# Altium schematic sheet 2_Microcontrolador.SchDoc
size A4; SheetNumber: 3; SheetTotal: 4; SPICEModelCacheOGEEZERP: <root> / <DocumentId>OGEEZERP</DocumentId> / </root>
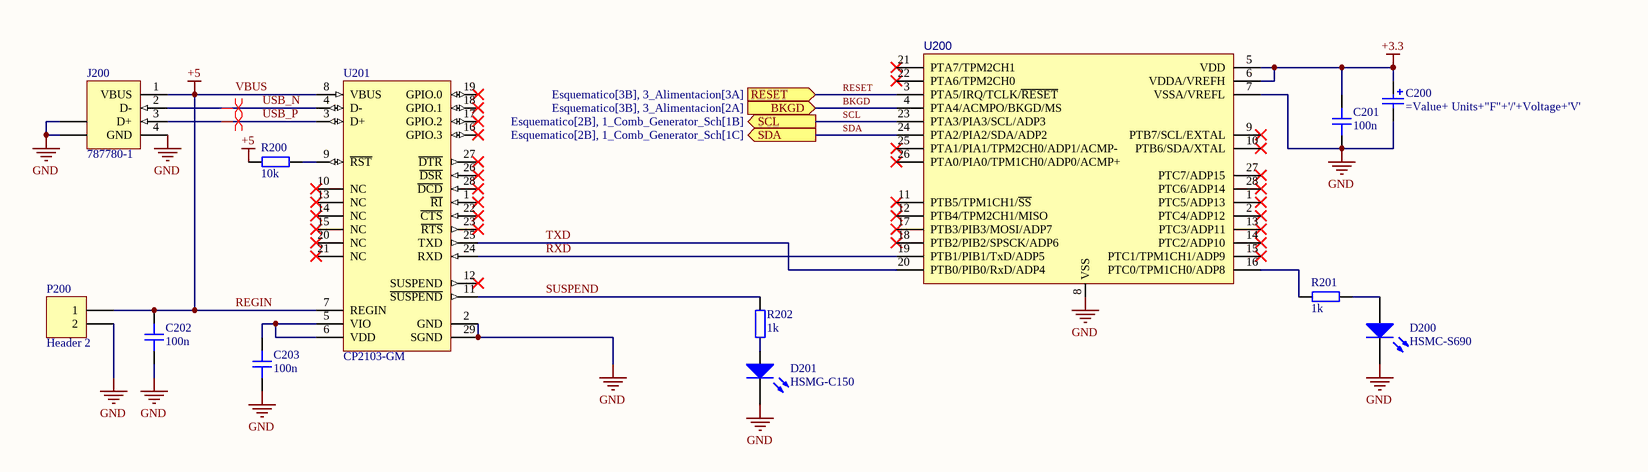
[diagram p0: 2_Microcontrolador.SchDoc]

## Parts
C200  (no value)  [C SIZE SMD CAPACITOR]
C201  100n  [CAP_0603]
C202  100n  [CAP_0603]
C203  100n  [CAP_0603]
D200  HSMC-S690  [1.6X0.8X0.7]
D201  HSMG-C150  [3.2X1.6X1.1]
J200  787780-1  [USB 787780]
P200  Header 2  [HDR1X2]
R200  10k  [RES_0603]
R201  1k  [RES_0603]
R202  1k  [RES_0603]
U200  (no value)  [TSSOP28_25.5_295_15X58_SMD]
U201  CP2103-GM  [SLAB-QFN-28-3125x3125TP_A_N]

## Ports
BKGD (in, see Esquematico[3B], 3_Alimentacion[2A]), RESET (in, see Esquematico[3B], 3_Alimentacion[3A]), SCL (out, see Esquematico[2B], 1_Comb_Generator_Sch[1B]), SDA (out, see Esquematico[2B], 1_Comb_Generator_Sch[1C])

## Nets
+3.3: C200.1 C201.1 U200.5(VDD) U200.6(VDDA/VREFH)
GND: C200.2 C201.2 C202.2 C203.2 D200.2(K) D201.2(K) J200.4(GND) J200.5(SHLD) J200.6(SHLD) P200.2 U200.7(VSSA/VREFL) U200.8(VSS) U201.2(GND) U201.29(SGND)
REGIN: C202.1 J200.1(VBUS) P200.1 R200.2 U201.7(REGIN) U201.8(VBUS)  [also labelled +5, VBUS]
BKGD: U200.4(PTA4/ACMPO/BKGD/MS) ; port BKGD
RESET: U200.3(PTA5/IRQ/TCLK/~{RESET}) ; port RESET
RXD: U200.19(PTB1/PIB1/TxD/ADP5) U201.24(RXD)
SCL: U200.23(PTA3/PIA3/SCL/ADP3) ; port SCL
SDA: U200.24(PTA2/PIA2/SDA/ADP2) ; port SDA
SUSPEND: R202.1 U201.11(~{SUSPEND})
TXD: U200.20(PTB0/PIB0/RxD/ADP4) U201.25(TXD)
USB_N: J200.2(D-) U201.4(D-)
USB_P: J200.3(D+) U201.3(D+)
NetC203_1: C203.1 U201.5(VIO) U201.6(VDD)
NetD200_1: D200.1(A) R201.2
NetD201_1: D201.1(A) R202.2
NetR200_1: R200.1 U201.9(~{RST})
NetR201_1: R201.1 U200.16(PTC0/TPM1CH0/ADP8)

Not connected (* = marked no-connect by the designer): U200 1(PTC5/ADP13)* 2(PTC4/ADP12)* 9(PTB7/SCL/EXTAL)* 10(PTB6/SDA/XTAL)* 11(PTB5/TPM1CH1/~{SS})* 12(PTB4/TPM2CH1/MISO)* 13(PTC3/ADP11)* 14(PTC2/ADP10)* 15(PTC1/TPM1CH1/ADP9)* 17(PTB3/PIB3/MOSI/ADP7)* 18(PTB2/PIB2/SPSCK/ADP6)* 21(PTA7/TPM2CH1)* 22(PTA6/TPM2CH0)* 25(PTA1/PIA1/TPM2CH0/ADP1/ACMP-)* 26(PTA0/PIA0/TPM1CH0/ADP0/ACMP+)* 27(PTC7/ADP15)* 28(PTC6/ADP14)*; U201 1(~{RI})* 10(NC)* 12(SUSPEND)* 13(NC)* 14(NC)* 15(NC)* 16(GPIO.3)* 17(GPIO.2)* 18(GPIO.1)* 19(GPIO.0)* 20(NC)* 21(NC)* 22(~{CTS})* 23(~{RTS})* 26(~{DSR})* 27(~{DTR})* 28(~{DCD})*

## Layout directives
differential pair; differential pair class USB: USB_N, USB_P

## Library data of the parts
C200 = Cap Pol1: Capacitor Electr. Alum. SMD WxLxH 6.3x6.3x5.3 Ǿ= 6 mm; Manufacturer: Generic Components; Class: Passive; Value: 47; PDT: PDT_GA500P+; CRITICO: NO; Voltage: 16; Diam: 6.3; Units: u; ASY_DESCRIPTION: Electrónica Galert 500P+; ASY_CRITICO: S; ELEMON: EH51EM470E05OC; Published: 08/06/2000; Publisher: Altium Hobart Technology Centre; SubClass: Capacitor; GAMMASYS: =C+auto_range + ''+Exponent+Material+Voltage+ PackageReference; ASY: =PS+PCB+'R'+PCB_REV; PackageReference: 0607; Height: 10; auto_range: =(NORM >= 1) * (NORM < 100) * NORM + (NORM >= 1E2) * (NORM < 1E3) * NORM / 10 + (NORM >= 1E3) * (NORM < 1E4) * NORM / 1E2 + (NORM >= 1E4) * (NORM < 1E5) * NORM / 1E3 + (NORM >= 1E5) * (NORM < 1E6) * NORM / 1E4 + (NORM >= 1E6) * (NORM < 1E7) * NORM / 1E5 + (NORM >= 1E7) * (NORM < 1E8) * NORM / 1E6 + (NORM >= 1E8) * (NORM < 1E9) * NORM / 1E7 + (NORM >= 1E9) * (NORM < 1E10) * NORM / 1E8 + (NORM >= 1E10) * (NORM < 1E11) * NORM / 1E9; Exponent: =(NORM >= 1) * (NORM < 1E2) * 0 || (NORM >= 1E2) * (NORM < 1E3) * 1 || (NORM >= 1e3) * (NORM < 1e4) * 2 ||(NORM >= 1E4) * (NORM < 1E5) * 3 || (NORM >= 1E5) * (NORM < 1E6) * 4 || (NORM >= 1E6) * (NORM < 1E7) * 5 || (NORM >= 1E7) * (NORM < 1E8) * 6 || (NORM >= 1E8) * (NORM < 1E9) * 7 || (NORM >= 1E9) * (NORM < 1E10) * 8 || (NORM >= 1E10) * (NORM < 1E11) * 9; NORM: =-(not (Units <> m) * 1E3 + not (Units <> u)*1E0 )*Value
C201-C203 = CAP_0603: Capacitor SMD 0603; Manufacturer: *; Manufacturer Part Number: *; Distributor Link: *; LCSC: *; Rating: *; Dielectric: *
D200 = HSMC-S690: SMT Top Mount Chip LED, Red; LuminousIntensity: 16mcd (Minimum).; PCB_Layout: Complies with manufacturer's recommendation.; Published: 11-Dec-2002; DatasheetDocument: 29-Oct-2001; PackageDocument: 29-Oct-2001; PackageReference: 1.6X0.8X0.7; Publisher: Altium Limited; LED_Colour: Red; ComponentLink1Description: Manufacturer Link; ComponentLink1URL: http://www.agilent.com/; ComponentLink2Description: Datasheet; ComponentLink2URL: http://cp.literature.agilent.com/litweb/pdf/5988-4445EN.pdf
D201 = HSMG-C150: Surface Mount Chip LED, Green; LuminousIntensity: 4mcd (Minimum).; PCB_Layout: Complies with manufacturer's recommendation.; Published: 11-Dec-2002; DatasheetDocument: 30-Apr-2002; PackageDocument: 26-Feb-2002; PackageReference: 3.2X1.6X1.1; Publisher: Altium Limited; LED_Colour: Green; ComponentLink1Description: Manufacturer Link; ComponentLink1URL: http://www.agilent.com/; ComponentLink2Description: Datasheet; ComponentLink2URL: http://cp.literature.agilent.com/litweb/pdf/5988-6271EN.pdf
J200 = 787780-1: USB 1.1, Right Angle, Thru-Hole, B Type, Receptacle, 4 Position, Black; ContactMaterial: Copper Alloy; ContactPlating: Gold Flash over Palladium Nickel or Gold (30) over Nickel; TerminationLength: 3.00mm [0.118in.]; PCB_Layout: Complies with manufacturer's recommendation.; DrillSize: Corresponds to nominal value.; PanelGround: Without; Published: 15-Jul-2004; DatasheetDocument: 11-Jan-2004; PackageDocument: 11-Jan-2004; PackageReference: 787780; Publisher: Altium Limited; HousingMaterial: Thermoplastic; ComponentLink1Description: Manufacturer Link; ComponentLink1URL: http://www.tycoelectronics.com/; ComponentLink2Description: Packaging Specification; ComponentLink2URL: http://ecommas.tycoelectronics.com/commerce/DocumentDelivery/DDEController?Action=showdoc&DocId=Customer+Drawing%7F787780%7FF%7Ftif%7FEnglish%7FENG_CD_787780_F.tif
P200 = Header 2: Header, 2-Pin; LatestRevisionDate: 17-Jul-2002; LatestRevisionNote: Re-released for DXP Platform.; Publisher: Altium Limited
R200-R202 = RES_0603: Resistor SMD 0603; Manufacturer: *; Manufacturer Part Number: *; Distributor Link: *; LCSC: *
U200 = MC9S08SH32CTL: IC MCU 8BIT 32KB FLASH 28TSSOP / WITH AUTO-DIRECTION SENSING AND ±15-kV ESD PROTECTION; Part Number: MC9S08SH32CTL_TSSOP28; Manufacturer: NXP USA Inc.; Publico: AP; Value: MC9S08SH32; Manufacturer Part Number: MC9S08SH32CTL; Supplier 1: Digi-Key; Supplier Part Number 1: MC9S08SH32CTL-ND; Aprobo: -
U201 = CP2103-GM: Single-Chip USB to UART Bridge, 1024 Bytes EEPROM, -40 to 85 degC, 28-pin QFN, Tube; Manufacturer: Silicon Labs; Internal Oscillator: TRUE; Sub-Family: USB Bridges; DatasheetVersion: Rev. 1.0; PackageReference: QFN-28; PackageDescription: 28-Pin Quad-Flat No-Leads Package, Body 5 x 5 mm, Pitch 0.5 mm; Supplier 1: Digi-Key; Supplier Part Number 1: 336-1164-ND; Supplier 2: Farnell; Supplier Part Number 2: 1291538; Supplier 3: Newark; Supplier Part Number 3: 24M1109; Supplier 4: Mouser; Supplier Part Number 4: 634-CP2103-GM; EEPROM: 1024 Bytes; Mounting Technology: Surface Mount; PartNumber: CP2103-GM; ComponentLink1Description: Manufacturer URL; ComponentLink1URL: http://www.silabs.com/; ComponentLink2Description: Datasheet; ComponentLink2URL: http://www.silabs.com/Support%20Documents/TechnicalDocs/CP2103.pdf; ComponentLink3Description: Package Specification; ComponentLink3URL: http://www.silabs.com/Support%20Documents/TechnicalDocs/C8051F35x.pdf